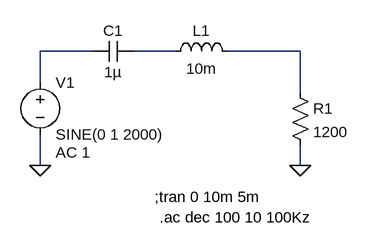
[diagram p0: schematic Draft3.asc]
Draft3.asc, the LTspice schematic file:
Version 4
SHEET 1 880 680
WIRE 160 80 80 80
WIRE 288 80 224 80
WIRE 480 80 368 80
WIRE 80 128 80 80
WIRE 480 144 480 80
WIRE 80 256 80 208
WIRE 480 256 480 224
FLAG 80 256 0
FLAG 480 256 0
SYMBOL voltage 80 112 R0
WINDOW 123 24 124 Left 2
WINDOW 39 0 0 Left 0
SYMATTR InstName V1
SYMATTR Value SINE(0 1 2000)
SYMATTR Value2 AC 1
SYMBOL cap 224 64 R90
WINDOW 0 0 32 VBottom 2
WINDOW 3 32 32 VTop 2
SYMATTR InstName C1
SYMATTR Value 1µ
SYMBOL ind 272 96 R270
WINDOW 0 32 56 VTop 2
WINDOW 3 5 56 VBottom 2
SYMATTR InstName L1
SYMATTR Value 10m
SYMBOL res 464 128 R0
SYMATTR InstName R1
SYMATTR Value 1200
TEXT 256 304 Left 2 !;tran 0 10m 5m
TEXT 264 336 Left 2 !.ac dec 100 10 100Kz

The netlist it stands for:
* Draft3.asc
V1 N001 0 SINE(0 1 2000) AC 1
C1 N002 N001 1µ
L1 N002 N003 10m
R1 N003 0 1200
;tran 0 10m 5m
.ac dec 100 10 100Kz
.backanno
.end